# Altium schematic sheet tof.SchDoc
size Tabloid; SheetNumber: 4; SheetTotal: 4; Page: Time of Flight Sensor
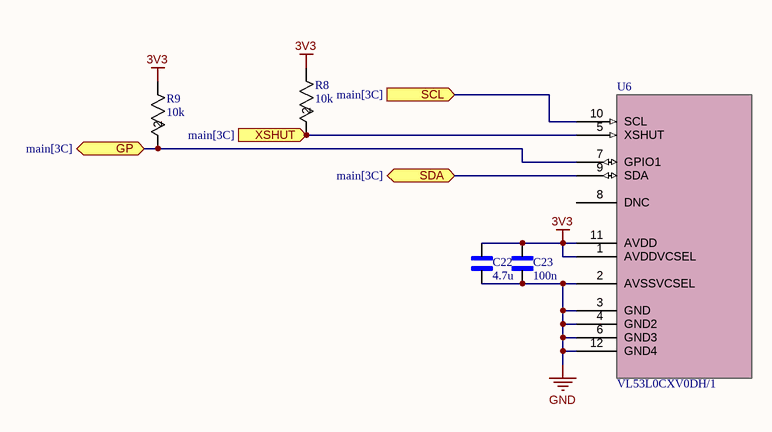
[diagram p0: tof.SchDoc]

## Parts
C22  4.7u  [CAPC1005X55N]
C23  100n  [CAPC1005X55N]
R8  10k  [RC0603N_YAG]
R9  10k  [RC0603N_YAG]
U6  VL53L0CXV0DH/1  [LGA12_STM]

## Ports
GP (bidir, see main[3C]), SCL (in, see main[3C]), SDA (bidir, see main[3C]), XSHUT (in, see main[3C])

## Nets
3V3: C22.2 C23.2 R8.1 R9.1 U6.1(AVDDVCSEL) U6.11(AVDD)
GND: C22.1 C23.1 U6.2(AVSSVCSEL) U6.3(GND) U6.4(GND2) U6.6(GND3) U6.12(GND4)
GP: R9.2 U6.7(GPIO1) ; port GP
SCL: U6.10(SCL) ; port SCL
SDA: U6.9(SDA) ; port SDA
XSHUT: R8.2 U6.5(XSHUT) ; port XSHUT

Not connected (* = marked no-connect by the designer): U6 8(DNC)

## Notes on the sheet
- Board
- Page
- Author
- Date:
- File:

## Library data of the parts
C22 = GRM155R60J475M: CAP CER 4.7UF 6.3V X5R 0402; MF: {'manufacturer': u'Taiyo Yuden'}; Package: None; Price: None; Value: *; MP: GRM155R60J475M; Availability: Unavailable; Manufacturer_Part_Number: GRM155R60J475M
C23 = UMK105B7104KVHF: CAP CER 0.1UF 50V X7R 0402; MF: {'manufacturer': u'Taiyo Yuden'}; Package: None; Price: None; Value: *; MP: UMK105B7104KVHF; Availability: Unavailable; Manufacturer_Part_Number: UMK105B7104KVHF
R8 R9 = RT0603BRD0710KL: 10K OHM 0.1% 1/10W 0603; Manufacturer_Name: Yageo; Copyright: Copyright (C) 2026 Ultra Librarian. All rights reserved.; Manufacturer_Part_Number: RT0603BRD0710KL
U6 = VL53L0CXV0DH1: Time-of-Flight (ToF) ranging sensor; Manufacturer_Name: STMicroelectronics; Copyright: Copyright (C) 2026 Ultra Librarian. All rights reserved.; Manufacturer_Part_Number: VL53L0CXV0DH/1; RefDes: RefDes; Type: Type